# Altium schematic sheet PSU_Manager.SchDoc: Project Title
size A3; ApprovedBy: Yves Chevallier; CheckedBy: Yves Chevallier; Author: Yves Chevallier; CompanyName: EPFL; DrawnBy: Yves Chevallier; Engineer: Yves Chevallier; Organization: EPFL; Address1: EPFL; Address2: CH1015 Lausanne; Address3: +41(0)21 693 36 98; Address4: +41(0)21 693 26 00; DocumentNumber: ABC.00.0000.000.0; Revision: v1.0; SheetNumber: 0; SheetTotal: 0; DrawnByDate: 2000-01-01; ExecutionWarrantDate: 2000-01-01; ExecutionWarrant: Yves Chevallier; Context: Confidential; PageSetup: Record=PageOptions|CenterHorizontal=True|CenterVertical=False|PrintScale=0.97|XCorrection=1.00|YCorrection=1.00|PrintKind=0|BorderSize=5000000|LeftOffset=0|BottomOffset=0|Orientation=2|PaperLength=1000|PaperWidth=1000|Scale=100|PaperSource=262|PrintQuality=600|MediaType=1|DitherType=10|PaperKind=A4|PrintScaleMode=1; EngineerDate: 2000-01-01; CheckedByDate: 2000-01-01; ProjectName: PRJ
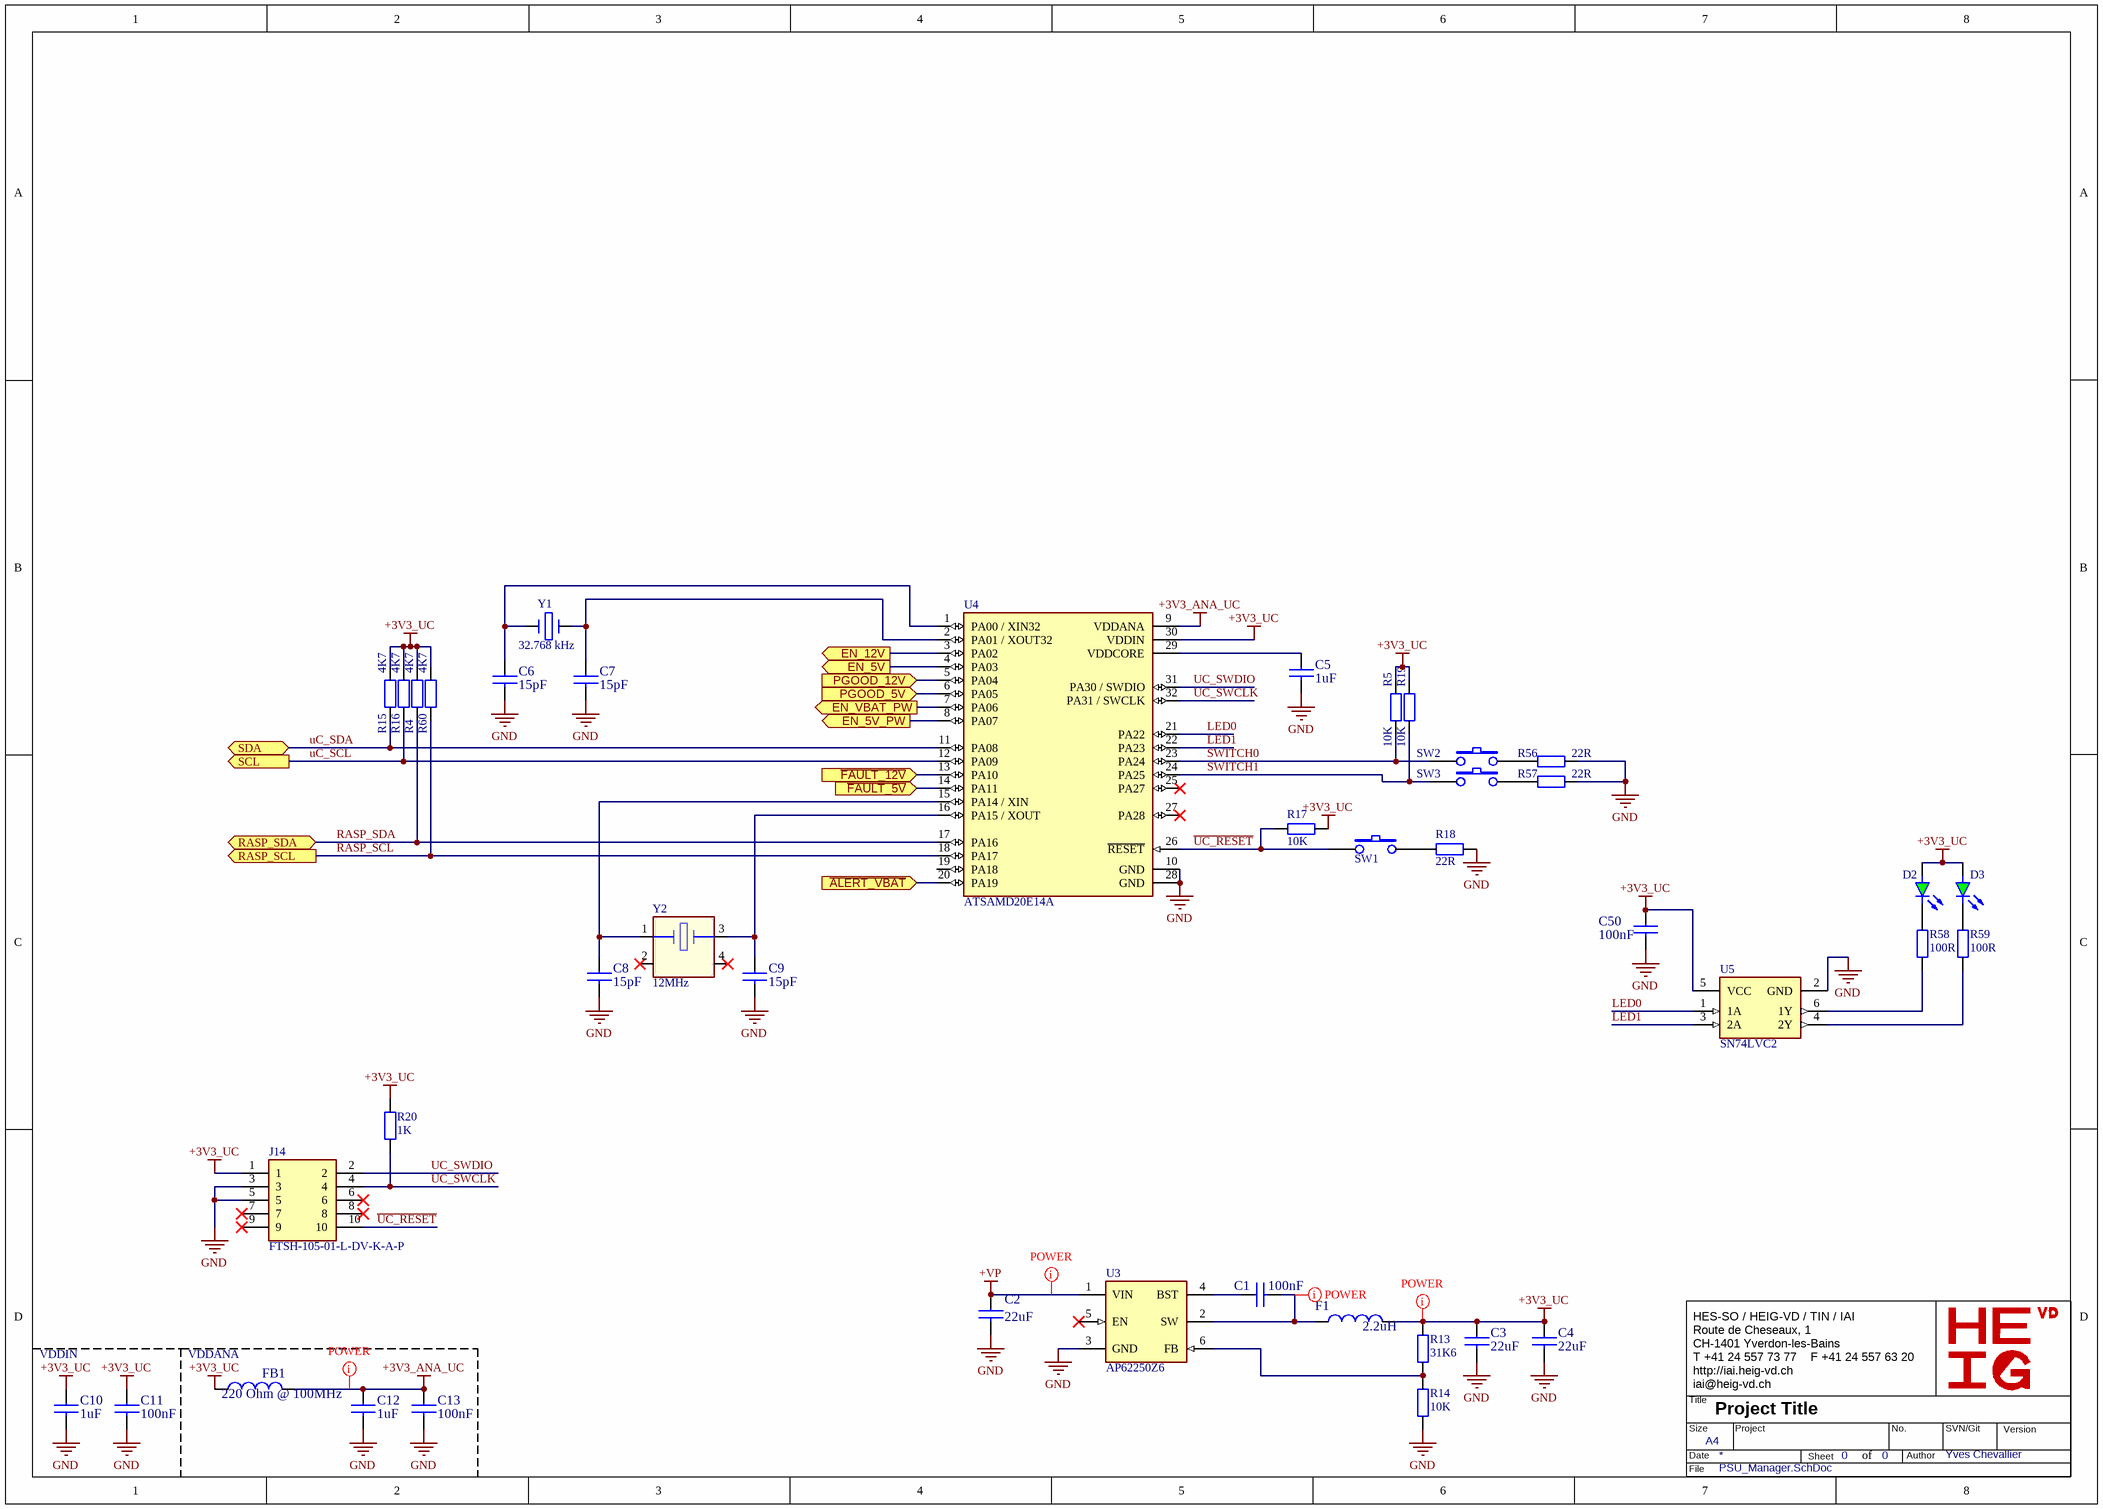
[diagram p0: PSU_Manager.SchDoc]

## Parts
C1  100nF  [SM/C_0603]
C2  22uF  [SM/C_1210]
C3  22uF  [SM/C_1210]
C4  22uF  [SM/C_1210]
C5  1uF  [SM/C_0603]
C6  15pF  [SM/C_0603]
C7  15pF  [SM/C_0603]
C8  15pF  [SM/C_0603]
C9  15pF  [SM/C_0603]
C10  1uF  [SM/C_0603]
C11  100nF  [SM/C_0603]
C12  1uF  [SM/C_0603]
C13  100nF  [SM/C_0603]
C50  100nF  [SM/C_0603]
D2  Green  [WL-SMCW_0603 - Green]  (value not drawn)
D3  Green  [WL-SMCW_0603 - Green]  (value not drawn)
F1  2.2uH  [TDK_SELF-SERIE VLS5045]
FB1  220 Ohm @ 100MHz  [SM/L_0603]
J14  FTSH-105-01-L-DV-K-A-P  [FTSH-105-XX-YYY-DV-K-A-P-TR]
R4  4K7  [SM/R_0603]
R5  10K  [SM/R_0603]
R13  31K6  [SM/R_0603]
R14  10K  [SM/R_0603]
R15  4K7  [SM/R_0603]
R16  4K7  [SM/R_0603]
R17  10K  [SM/R_0603]
R18  22R  [SM/R_0603]
R19  10K  [SM/R_0603]
R20  1K  [SM/R_0603]
R56  22R  [SM/R_0603]
R57  22R  [SM/R_0603]
R58  100R  [SM/R_0603]
R59  100R  [SM/R_0603]
R60  4K7  [SM/R_0603]
SW1  SW_PUSHBUTTON  [Omron_SWITCH_B3U-1000P]  (value not drawn)
SW2  SW_PUSHBUTTON  [Omron_SWITCH_B3U-1000P]  (value not drawn)
SW3  SW_PUSHBUTTON  [Omron_SWITCH_B3U-1000P]  (value not drawn)
U3  AP62250Z6  [SOT563-6]
U4  ATSAMD20E14A  [VFQFN-32_(32-Lead LFCSP_VQ)]
U5  SN74LVC2  [SOT23-6]
Y1  32.768 kHz  [ABRACON_CRYSTAL_ABS06 SERIES]
Y2  12MHz  [ABRACON_CRYSTAL_ABM10AIG SERIES]

## Ports
EN_5V (out), EN_5V_PW (out), EN_12V (out), EN_VBAT_PW (out), PGOOD_5V (in), PGOOD_12V (in), RASP_SCL (out), RASP_SDA (bidir), SCL (out), SDA (bidir), ~{ALERT_VBAT} (in), ~{FAULT_5V} (in), ~{FAULT_12V} (in)

## Nets
+3V3_ANA_UC: C12.1 C13.1 FB1.2 U4.9(VDDANA)
+3V3_UC: C3.1 C4.1 C10.1 C11.1 C50.1 D2.2(A) D3.2(A) F1.2 FB1.1 J14.1 R4.1 R5.2 R13.1 R15.1 R16.1 R17.2 R19.2 R20.1 R60.1 U4.30(VDDIN) U5.5(VCC)
+VP: C2.1 U3.1(VIN)
GND: C2.2 C3.2 C4.2 C5.2 C6.2 C7.2 C8.2 C9.2 C10.2 C11.2 C12.2 C13.2 C50.2 J14.3 J14.5 R14.2 R18.2 R56.2 R57.2 U3.3(GND) U4.10(GND) U4.28(GND) U5.2(GND)
~{ALERT_VBAT}: U4.20(PA19) ; port ~{ALERT_VBAT}
~{FAULT_5V}: U4.14(PA11) ; port ~{FAULT_5V}
~{FAULT_12V}: U4.13(PA10) ; port ~{FAULT_12V}
~{UC_RESET}: J14.10 R17.1 SW1.1 U4.26(~{RESET})
EN_5V: U4.4(PA03) ; port EN_5V
EN_5V_PW: U4.8(PA07) ; port EN_5V_PW
EN_12V: U4.3(PA02) ; port EN_12V
EN_VBAT_PW: U4.7(PA06) ; port EN_VBAT_PW
LED0: U4.21(PA22) U5.1(1A)
LED1: U4.22(PA23) U5.3(2A)
PGOOD_5V: U4.6(PA05) ; port PGOOD_5V
PGOOD_12V: U4.5(PA04) ; port PGOOD_12V
RASP_SCL: R60.2 U4.18(PA17) ; port RASP_SCL
RASP_SDA: R4.2 U4.17(PA16) ; port RASP_SDA
SWITCH0: R5.1 SW2.1 U4.23(PA24)
SWITCH1: R19.1 SW3.1 U4.24(PA25)
uC_SCL: R16.2 U4.12(PA09) ; port SCL
uC_SDA: R15.2 U4.11(PA08) ; port SDA
UC_SWCLK: J14.4 R20.2 U4.32(PA31_/_SWCLK)
UC_SWDIO: J14.2 U4.31(PA30_/_SWDIO)
NetC1_1: C1.1 U3.4(BST)
NetC1_2: C1.2 F1.1 U3.2(SW)
NetC5_1: C5.1 U4.29(VDDCORE)
NetC6_1: C6.1 U4.1(PA00_/_XIN32) Y1.1
NetC7_1: C7.1 U4.2(PA01_/_XOUT32) Y1.2
NetC8_1: C8.1 U4.15(PA14_/_XIN) Y2.1
NetC9_1: C9.1 U4.16(PA15_/_XOUT) Y2.3
NetD2_1: D2.1(C) R58.1
NetD3_1: D3.1(C) R59.1
NetR13_2: R13.2 R14.1 U3.6(FB)
NetR18_1: R18.1 SW1.2
NetR56_1: R56.1 SW2.2
NetR57_1: R57.1 SW3.2
NetR58_2: R58.2 U5.6(1Y)
NetR59_2: R59.2 U5.4(2Y)

Not connected (* = marked no-connect by the designer): J14 6* 7* 8* 9*; U3 5(EN)*; U4 19(PA18) 25(PA27)* 27(PA28)*; Y2 2(GND)* 4(GND)*

## Layout directives
net class POWER_CLASS: +3V3_ANA_UC, +3V3_UC, +VP, NetC1_2

## Notes on the sheet
- (near C10) VDDIN
- (near FB1) VDDANA
- HES-SO / HEIG-VD / TIN / IAI
  Route de Cheseaux, 1
  CH-1401 Yverdon-les-Bains
  T +41 24 557 73 77    F +41 24 557 63 20
  http://iai.heig-vd.ch
  iai@heig-vd.ch
- Title
- Size
- Date
- A4
- Project
- Sheet
- of
- No.
- Author
- SVN/Git
- Version
- File

## Library data of the parts
C1 C11 C13 C50 = CAP CER 0.1UF 16V X7R 0603: Manufacturer: Samsung; Manufacturer P/N: CL10B104KO8WPNC; Tolerance: 10%; Supplier 1: Digikey; Supplier Part Number 2: 187-CL10B104KO8WPNC; Supplier 2: Mouser; Supplier Part Number 1: 1276-6582-1-ND; Value: 100nF; Voltage: 16V; Dielectric: X7R; ComponentLink1Description: Supplier; ComponentLink1URL: https://www.digikey.ch/products/fr?keywords=1276-6582-1-ND; ComponentLink2Description: Datasheet; ComponentLink2URL: https://www.mouser.ch/datasheet/2/585/MLCC_Automotive-1837966.pdf
C2-C4 = CAP CER 22UF 25V X5R 1210: Manufacturer: Samsung; Manufacturer P/N: CL32A226KAJNNWE; Tolerance: 10%; Supplier 1: Digikey; Supplier Part Number 2: 187-CL32A226KAJNNWE; Supplier 2: Mouser; Supplier Part Number 1: 1276-3369-1-ND; Voltage: 25V; Dielectric: X5R; ComponentLink1Description: Supplier; ComponentLink1URL: https://www.digikey.ch/product-detail/fr/samsung-electro-mechanics/CL32A226KAJNNWE/1276-3369-1-ND/3891455; ComponentLink2Description: Datasheet; ComponentLink2URL: https://www.mouser.ch/datasheet/2/585/MLCC-1837944.pdf; Value: 22uF
C5 C10 C12 = CAP CER 1UF 10V X7R 0603: Manufacturer: Samsung; Manufacturer P/N: CL10B105KP8NNNC; Tolerance: 10%; Supplier 1: Digikey; Supplier Part Number 2: 187-CL10B105KP8NNNC; Supplier 2: Mouser; Supplier Part Number 1: 1276-1946-1-ND; Value: 1uF; Voltage: 10V; Dielectric: X7R
C6-C9 = CAP CER 15PF 50V C0G/NP0 0603: Manufacturer: AVX; Manufacturer P/N: 06035A150JAT2A; Tolerance: 5%; Supplier 1: Digikey; Supplier Part Number 2: 581-06035A150J; Supplier 2: Mouser; Supplier Part Number 1: 478-1165-1-ND; Value: 15pF; Voltage: 50V; Dielectric: C0G/NP0; ComponentLink1Description: Supplier; ComponentLink1URL: https://www.digikey.ch/product-detail/fr/samsung-electro-mechanics/CL10A475KQ8NNWC/1276-1902-1-ND/3889988; ComponentLink2Description: Datasheet; ComponentLink2URL: https://www.mouser.ch/datasheet/2/585/MLCC-1837944.pdf
D2 D3 = LED GREEN CLEAR 0603 SMD: Manufacturer: Würth Elektronik; Manufacturer P/N: 150060GS75000; Supplier 1: Digikey; Supplier 2: Mouser; Supplier Part Number 1: 732-4971-1-ND; Supplier Part Number 2: 710-150060GS75000; Value: Green
F1 = FIXED IND 2.2UH 4.7A 28.6MOHM SMD: Manufacturer: TDK; Manufacturer P/N: VLS5045EX-2R2N; Supplier 1: Digikey; Supplier 2: Mouser; Supplier Part Number 1: 445-174850-1-ND; Supplier Part Number 2: 810-VLS5045EX-2R2N; ComponentLink1Description: Supplier; ComponentLink1URL: https://www.digikey.ch/product-detail/fr/tdk-corporation/VLS5045EX-2R2N/445-174850-1-ND/6560407; ComponentLink2Description: Datasheet; ComponentLink2URL: https://product.tdk.com/en/system/files?file=dam/doc/product/inductor/inductor/smd/catalog/inductor_commercial_power_vls5045ex_en.pdf; Value: 2.2uH
FB1 = FERRITE 220 Ohms 0603: FERRITE BEAD 220 OHM 0603 1LN; Manufacturer: Murata; Manufacturer P/N: BLM18PG221SN1D; Supplier 1: Digikey; Supplier 2: Mouser; Supplier Part Number 1: 490-5221-1-ND; Supplier Part Number 2: 81-BLM18PG221SN1D; Value: 220 Ohm @ 100MHz
J14 = CONN HEADER SMD 10POS 1.27MM: Manufacturer: Samtec; Manufacturer P/N: FTSH-105-01-L-DV-K-A-P; Supplier 1: Digikey; Supplier 2: Mouser; Supplier Part Number 1: SAM9440-ND; Supplier Part Number 2: 200-FTSH1051LDVKAPTR; Value: FTSH-105-01-L-DV-K-A-P
R4 R15 R16 R60 = RES SMD 4.7K OHM 1% 1/10W 0603: Manufacturer: Yageo; Manufacturer P/N: RC0603FR-074K7L; Power: 100mW; Voltage: 75V; Value: 4K7; Tolerance: 1%; Supplier 1: Digikey; Supplier Part Number 1: 311-4.70KHRCT-ND; ComponentLink1Description: Datasheet; ComponentLink1URL: https://www.yageo.com/upload/media/product/productsearch/datasheet/rchip/PYu-RC_Group_51_RoHS_L_11.pdf; ComponentLink2Description: Supplier; ComponentLink2URL: https://www.digikey.ch/product-detail/fr/yageo/RC0603FR-074K7L/311-4-70KHRCT-ND/730159; Supplier 2: Mouser; Supplier Part Number 2: 603-RC0603FR-074K7L
R5 R14 R17 R19 = RES SMD 10K OHM 1% 1/10W 0603: Résistance 0603 100mW 1% 10K; Manufacturer: Yageo; Manufacturer P/N: RC0603FR-0710KL; Voltage: 75V; Value: 10K; Power: 100mW; Tolerance: 1%; Supplier 1: Digikey; Supplier Part Number 1: 311-10.0KHRCT-ND; ComponentLink1Description: Datasheet; ComponentLink1URL: https://www.yageo.com/upload/media/product/productsearch/datasheet/rchip/PYu-RC_Group_51_RoHS_L_11.pdf; ComponentLink2Description: Supplier; ComponentLink2URL: https://www.digikey.ch/product-detail/fr/yageo/RC0603FR-0710KL/311-10-0KHRCT-ND/729827; Supplier 2: Mouser; Supplier Part Number 2: 603-RC0603FR-0710KL
R13 = RES SMD 31.6K OHM 1% 1/10W 0603: Manufacturer: Yageo; Manufacturer P/N: RC0603FR-0731K6L; Power: 100mW; Voltage: 75V; Value: 31K6; Tolerance: 1%; Supplier 1: Digikey; Supplier Part Number 1: 311-31.6KHRCT-ND; ComponentLink1Description: Datasheet; ComponentLink1URL: https://www.mouser.ch/datasheet/2/447/Yageo_03_18_2021_PYu_RC_Group_51_RoHS_L_11-2199992.pdf; ComponentLink2Description: Supplier; ComponentLink2URL: https://www.digikey.ch/product-detail/fr/yageo/RC0603FR-0731K6L/311-31-6KHRCT-ND/730098; Supplier 2: Mouser; Supplier Part Number 2: 603-RC0603FR-0731K6L
R18 R56 R57 = RES SMD 22 OHM 1% 1/10W 0603: Manufacturer: Yageo; Manufacturer P/N: RC0603FR-0722RL; Power: 100mW; Voltage: 75V; Value: 22R; Tolerance: 1%; Supplier 1: Digikey; Supplier Part Number 1: 311-22.0HRCT-ND; ComponentLink1Description: Datasheet; ComponentLink1URL: https://www.yageo.com/upload/media/product/productsearch/datasheet/rchip/PYu-RC_Group_51_RoHS_L_11.pdf; ComponentLink2Description: Supplier; ComponentLink2URL: https://www.digikey.ch/product-detail/fr/yageo/RC0603FR-0710KL/311-10-0KHRCT-ND/729827; Supplier 2: Mouser; Supplier Part Number 2: 603-RC0603FR-0722RL
R20 = RES SMD 1K OHM 1% 1/10W 0603: Manufacturer: Yageo; Manufacturer P/N: RC0603FR-071KL; Power: 100mW; Voltage: 75V; Value: 1K; Tolerance: 1%; Supplier 1: Digikey; Supplier Part Number 1: 311-1.00KHRCT-ND; ComponentLink1Description: Datasheet; ComponentLink1URL: https://www.yageo.com/upload/media/product/productsearch/datasheet/rchip/PYu-RC_Group_51_RoHS_L_11.pdf; ComponentLink2Description: Supplier; ComponentLink2URL: https://www.digikey.ch/product-detail/fr/yageo/RC0603FR-071KL/311-1-00KHRCT-ND/729790; Supplier 2: Mouser; Supplier Part Number 2: 603-RC0603FR-071KL
R58 R59 = RES 100 OHM 1% 1/10W 0603: Manufacturer: Yageo; Manufacturer P/N: RC0603FR-07100RL; Power: 100mW; Voltage: 75V; Value: 100R; Tolerance: 1%; Supplier 1: Digikey; Supplier Part Number 1: 311-100HRCT-ND; Supplier 2: Mouser; Supplier Part Number 2: 603-RC0603FR-07100RL
SW1-SW3 = SWITCH TACTILE SPST-NO 0.05A 12V: Tactile Switch SPST-NO Top Actuated SMD; Manufacturer: Omron Electronics; Manufacturer P/N: B3U-1000P; ID: 1814; Value: B3U-1000P; Voltage: 12V; Component: SWITCH; Component Type Category Connector Type: SWITCH SPST-NO; Supplier 1: Digi-Key; Supplier Part Number 1: SW1020CT-ND; Supplier 2: Mouser; Supplier Part Number 2: 653-B3U-1000P; RoHS Compliant: True; ComponentLink1Description: Datasheet; ComponentLink1URL: http://www.omron.com/ecb/products/pdf/en-b3u.pdf; ComponentLink2Description: Supplier; ComponentLink2URL: http://www.mouser.ch/ProductDetail/Omron-Electronics/B3U-1000P/?qs=sGAEpiMZZMsgGjVA3toVBD%252bqDoRYvPtZBt73XVLWoZs%3d
U3 = AP62250Z6-7: DCDC CONV BUCK 3A SOT563; Manufacturer: Diodes Incorporated; Supplier 1: Digikey; Manufacturer P/N: AP62250Z6-7; Supplier 2: Mouser; Supplier Part Number 1: 31-AP62250Z6-7CT-ND; Supplier Part Number 2: 621-AP62250Z6-7; Value: AP62250Z6-7; ComponentLink1Description: Supplier; ComponentLink1URL: https://www.digikey.ch/product-detail/fr/diodes-incorporated/AP62250Z6-7/31-AP62250Z6-7CT-ND/12349406; ComponentLink2Description: Datasheet; ComponentLink2URL: https://www.diodes.com/assets/Datasheets/AP62250.pdf
U4 = IC MCU 32BIT 16KB FLASH 32QFN: Manufacturer: Microchip; Manufacturer P/N: ATSAMD20E14A-MUT; Value: ATSAMD20E14A; Supplier 1: Digikey; Supplier 2: Mouser; Supplier Part Number 1: ATSAMD20E14A-MUTCT-ND; Supplier Part Number 2: 556-ATSAMD20E14A-MUT
U5 = SN74LVC2GU04DBVR: IC INVERTER 2CH 2-INP SOT23-6; Manufacturer: Texas Instruments; Value: SN74LVC2; Manufacturer P/N: SN74LVC2GU04DBVR; Supplier 1: Digikey; Supplier 2: Mouser; Supplier Part Number 1: 296-13276-1-ND; Supplier Part Number 2: 595-SN74LVC2GU04DBVR
Y1 = CRYSTAL 32.7680KHZ 12.5PF SMD: Manufacturer: Abracon LLC; Manufacturer P/N: ABS06-32.768KHZ-T; Supplier 1: Digikey; Supplier 2: Mouser; Supplier Part Number 1: 535-10104-1-ND; Supplier Part Number 2: 815-ABS06-32.768K-T; Value: 32.768 kHz
Y2 = CRYSTAL 12.0000MHZ 10PF SMD: Manufacturer: Abracon LLC; Manufacturer P/N: ABM10AIG-12.000MHZ-4Z-T3; Supplier 1: Digikey; Supplier 2: Mouser; Supplier Part Number 1: 535-13360-1-ND; Supplier Part Number 2: 815-M10AIG-12-4ZT3; Value: 12MHz